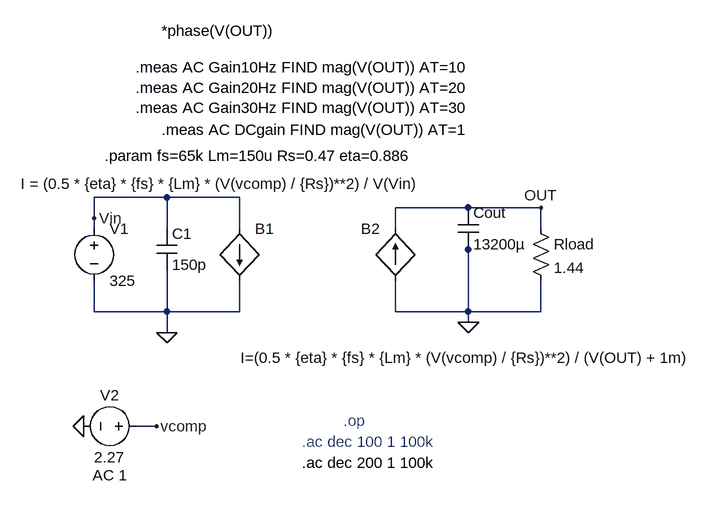
[diagram p0: schematic smallsignal_averaged.asc]
smallsignal_averaged.asc, the LTspice schematic file:
Version 4.1
SHEET 1 1312 680
WIRE 64 80 -48 80
WIRE 176 80 64 80
WIRE 528 96 416 96
WIRE 640 96 528 96
WIRE -48 112 -48 80
WIRE -48 128 -48 112
WIRE 64 128 64 80
WIRE 176 128 176 80
WIRE 416 128 416 96
WIRE 640 128 640 96
WIRE 528 160 528 144
WIRE -48 256 -48 208
WIRE 64 256 64 192
WIRE 64 256 -48 256
WIRE 176 256 176 208
WIRE 176 256 64 256
WIRE 416 256 416 208
WIRE 528 256 528 160
WIRE 528 256 416 256
WIRE 640 256 640 208
WIRE 640 256 528 256
WIRE 528 272 528 256
WIRE 64 288 64 256
WIRE 48 432 16 432
FLAG 64 288 0
FLAG 528 272 0
FLAG 48 432 vcomp
FLAG 640 96 OUT
FLAG -48 112 Vin
FLAG -64 432 0
SYMBOL voltage -48 112 R0
WINDOW 123 0 0 Left 0
WINDOW 39 0 0 Left 0
SYMATTR InstName V1
SYMATTR Value 325
SYMBOL bi 176 128 R0
WINDOW 3 -337 -69 Left 2
SYMATTR Value I = (0.5 * {eta} * {fs} * {Lm} * (V(vcomp) / {Rs})**2) / V(Vin)
SYMATTR InstName B1
SYMBOL cap 48 128 R0
SYMATTR InstName C1
SYMATTR Value 150p
SYMBOL bi 416 208 R180
WINDOW 0 24 80 Left 2
WINDOW 3 -457 -119 Left 2
SYMATTR InstName B2
SYMATTR Value I=(0.5 * {eta} * {fs} * {Lm} * (V(vcomp) / {Rs})**2) / (V(OUT) + 1m)
SYMBOL cap 512 96 R0
SYMATTR InstName Cout
SYMATTR Value 13200µ
SYMATTR SpiceLine Rser=9m
SYMBOL res 624 112 R0
SYMATTR InstName Rload
SYMATTR Value 1.44
SYMBOL voltage 32 432 R90
WINDOW 0 -32 56 VBottom 2
WINDOW 3 32 56 VTop 2
WINDOW 123 60 56 VTop 2
WINDOW 39 0 0 Left 0
SYMATTR InstName V2
SYMATTR Value 2.27
SYMATTR Value2 AC 1
TEXT -32 16 Left 2 !.param fs=65k Lm=150u Rs=0.47 eta=0.886
TEXT 336 424 Left 2 ;.op
TEXT 272 456 Left 2 ;.ac dec 100 1 100k
TEXT 272 488 Left 2 !.ac dec 200 1 100k
TEXT 56 -24 Left 2 !.meas AC DCgain FIND mag(V(OUT)) AT=1
TEXT 16 -120 Left 2 !.meas AC Gain10Hz FIND mag(V(OUT)) AT=10\n.meas AC Gain20Hz FIND mag(V(OUT)) AT=20\n.meas AC Gain30Hz FIND mag(V(OUT)) AT=30
TEXT 56 -176 Left 2 !*phase(V(OUT))

The netlist it stands for:
* smallsignal_averaged.asc
V1 Vin 0 325
B1 Vin 0 I = (0.5 * {eta} * {fs} * {Lm} * (V(vcomp) / {Rs})**2) / V(Vin)
C1 Vin 0 150p
B2 0 OUT I=(0.5 * {eta} * {fs} * {Lm} * (V(vcomp) / {Rs})**2) / (V(OUT) + 1m)
Cout OUT 0 13200µ Rser=9m
Rload OUT 0 1.44
V2 vcomp 0 2.27 AC 1
.param fs=65k Lm=150u Rs=0.47 eta=0.886
* .op
* .ac dec 100 1 100k
.ac dec 200 1 100k
.meas AC DCgain FIND mag(V(OUT)) AT=1
.meas AC Gain10Hz FIND mag(V(OUT)) AT=10
.meas AC Gain20Hz FIND mag(V(OUT)) AT=20
.meas AC Gain30Hz FIND mag(V(OUT)) AT=30
*phase(V(OUT))
.backanno
.end